# Altium schematic sheet buffer.SchDoc
size A3
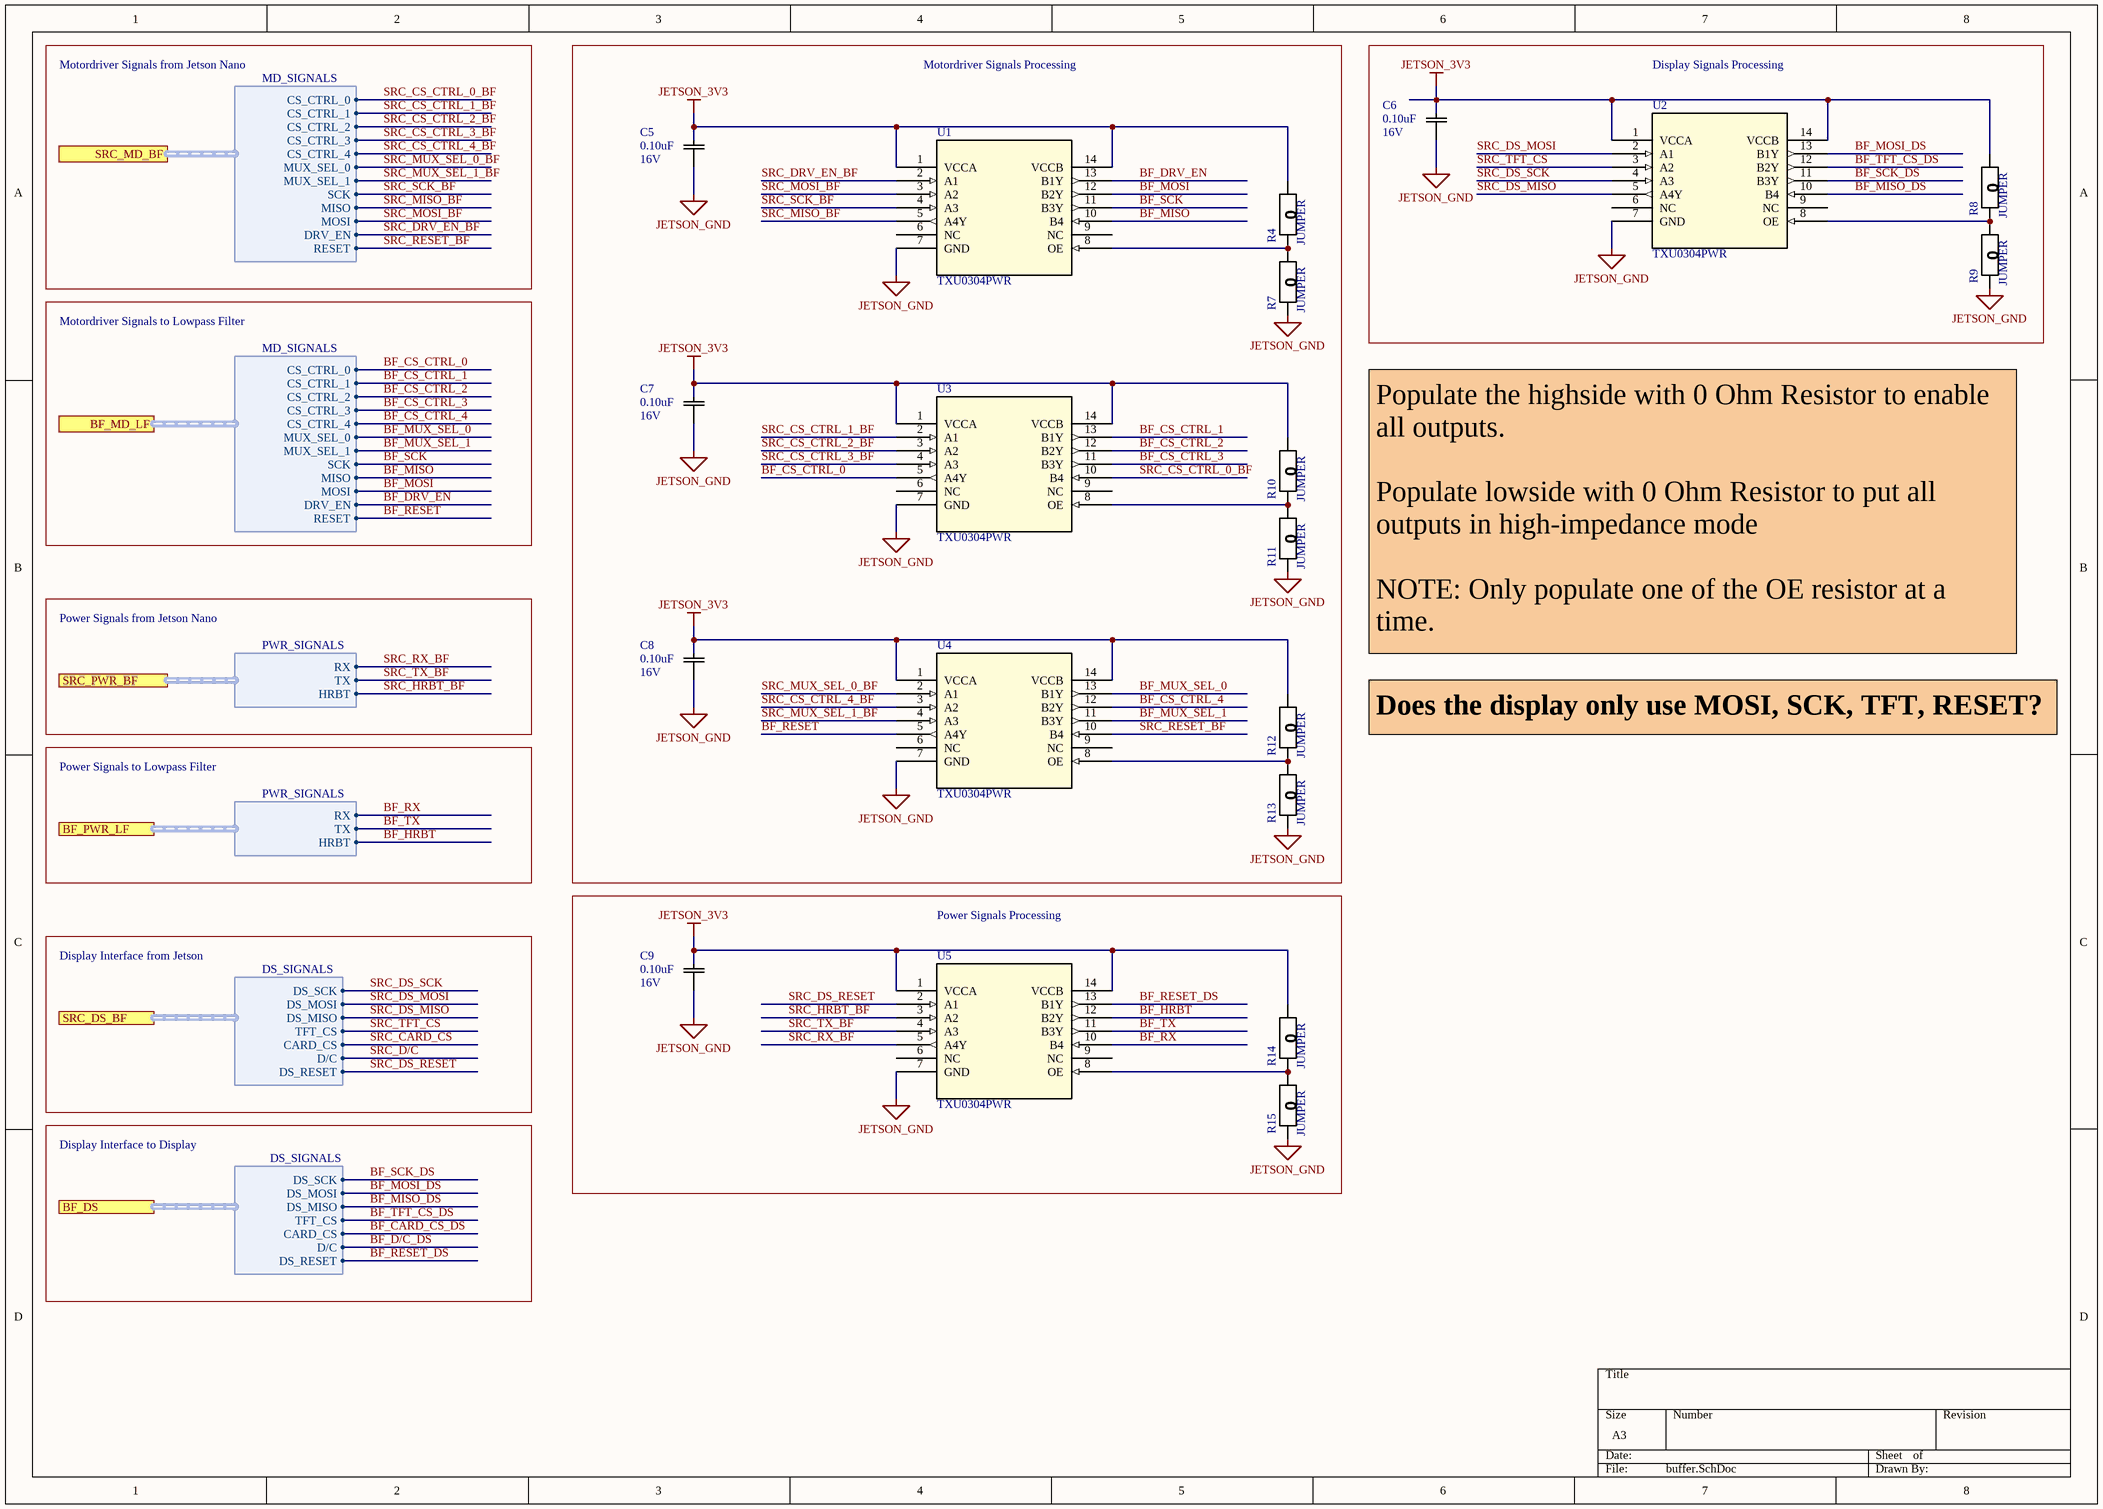
[diagram p0: buffer.SchDoc]

## Parts
C5  Rating: 16V  [0603]  (hidden comment: 0.10uF)
C6  Rating: 16V  [0603]  (hidden comment: 0.10uF)
C7  Rating: 16V  [0603]  (hidden comment: 0.10uF)
C8  Rating: 16V  [0603]  (hidden comment: 0.10uF)
C9  Rating: 16V  [0603]  (hidden comment: 0.10uF)
R4  JUMPER  [0603]
R7  JUMPER  [0603]
R8  JUMPER  [0603]
R9  JUMPER  [0603]
R10  JUMPER  [0603]
R11  JUMPER  [0603]
R12  JUMPER  [0603]
R13  JUMPER  [0603]
R14  JUMPER  [0603]
R15  JUMPER  [0603]
U1  TXU0304PWR  [14-TSSOP]
U2  TXU0304PWR  [14-TSSOP]
U3  TXU0304PWR  [14-TSSOP]
U4  TXU0304PWR  [14-TSSOP]
U5  TXU0304PWR  [14-TSSOP]

## Blocks framed on the sheet
Motordriver Signals Processing: C5 C7 C8 R4 R7 R10-R13 U1 U3 U4
Display Signals Processing: C6 R8 R9 U2
Power Signals Processing: C9 R14 R15 U5

## Ports
BF_DS (harness DS_SIGNALS), BF_MD_LF (harness MD_SIGNALS), BF_PWR_LF (harness PWR_SIGNALS), SRC_DS_BF (harness DS_SIGNALS), SRC_MD_BF (harness MD_SIGNALS), SRC_PWR_BF (harness PWR_SIGNALS)

## Harnesses
PWR_SIGNALS: TX, RX, HRBT
MD_SIGNALS: CS_CTRL_0, MUX_SEL_1, SCK, MOSI, MISO, CS_CTRL_1, CS_CTRL_2, CS_CTRL_3, CS_CTRL_4, MUX_SEL_0, DRV_EN, RESET
DS_SIGNALS: DS_SCK, DS_MOSI, DS_MISO, TFT_CS, CARD_CS, D/C, DS_RESET

## Nets
JETSON_3V3: C5.1(C1) C6.1(C1) C7.1(C1) C8.1(C1) C9.1(C1) R4.1(R1) R8.1(R1) R10.1(R1) R12.1(R1) R14.1(R1) U1.1(VCCA) U1.14(VCCB) U2.1(VCCA) U2.14(VCCB) U3.1(VCCA) U3.14(VCCB) U4.1(VCCA) U4.14(VCCB) U5.1(VCCA) U5.14(VCCB)
JETSON_GND: C5.2(C2) C6.2(C2) C7.2(C2) C8.2(C2) C9.2(C2) R7.2(R2) R9.2(R2) R11.2(R2) R13.2(R2) R15.2(R2) U1.7(GND) U2.7(GND) U3.7(GND) U4.7(GND) U5.7(GND)
BF_CARD_CS_DS: port BF_DS.CARD_CS
BF_CS_CTRL_0: U3.5(A4Y) ; port BF_MD_LF.CS_CTRL_0
BF_CS_CTRL_1: U3.13(B1Y) ; port BF_MD_LF.CS_CTRL_1
BF_CS_CTRL_2: U3.12(B2Y) ; port BF_MD_LF.CS_CTRL_2
BF_CS_CTRL_3: U3.11(B3Y) ; port BF_MD_LF.CS_CTRL_3
BF_CS_CTRL_4: U4.12(B2Y) ; port BF_MD_LF.CS_CTRL_4
BF_D/C_DS: port BF_DS.D/C
BF_DRV_EN: U1.13(B1Y) ; port BF_MD_LF.DRV_EN
BF_HRBT: U5.12(B2Y) ; port BF_PWR_LF.HRBT
BF_MISO: U1.10(B4) ; port BF_MD_LF.MISO
BF_MISO_DS: U2.10(B4) ; port BF_DS.DS_MISO
BF_MOSI: U1.12(B2Y) ; port BF_MD_LF.MOSI
BF_MOSI_DS: U2.13(B1Y) ; port BF_DS.DS_MOSI
BF_MUX_SEL_0: U4.13(B1Y) ; port BF_MD_LF.MUX_SEL_0
BF_MUX_SEL_1: U4.11(B3Y) ; port BF_MD_LF.MUX_SEL_1
BF_RESET: U4.5(A4Y) ; port BF_MD_LF.RESET
BF_RESET_DS: U5.13(B1Y) ; port BF_DS.DS_RESET
BF_RX: U5.10(B4) ; port BF_PWR_LF.RX
BF_SCK: U1.11(B3Y) ; port BF_MD_LF.SCK
BF_SCK_DS: U2.11(B3Y) ; port BF_DS.DS_SCK
BF_TFT_CS_DS: U2.12(B2Y) ; port BF_DS.TFT_CS
BF_TX: U5.11(B3Y) ; port BF_PWR_LF.TX
SRC_CARD_CS: port SRC_DS_BF.CARD_CS
SRC_CS_CTRL_0_BF: U3.10(B4) ; port SRC_MD_BF.CS_CTRL_0
SRC_CS_CTRL_1_BF: U3.2(A1) ; port SRC_MD_BF.CS_CTRL_1
SRC_CS_CTRL_2_BF: U3.3(A2) ; port SRC_MD_BF.CS_CTRL_2
SRC_CS_CTRL_3_BF: U3.4(A3) ; port SRC_MD_BF.CS_CTRL_3
SRC_CS_CTRL_4_BF: U4.3(A2) ; port SRC_MD_BF.CS_CTRL_4
SRC_D/C: port SRC_DS_BF.D/C
SRC_DRV_EN_BF: U1.2(A1) ; port SRC_MD_BF.DRV_EN
SRC_DS_MISO: U2.5(A4Y) ; port SRC_DS_BF.DS_MISO
SRC_DS_MOSI: U2.2(A1) ; port SRC_DS_BF.DS_MOSI
SRC_DS_RESET: U5.2(A1) ; port SRC_DS_BF.DS_RESET
SRC_DS_SCK: U2.4(A3) ; port SRC_DS_BF.DS_SCK
SRC_HRBT_BF: U5.3(A2) ; port SRC_PWR_BF.HRBT
SRC_MISO_BF: U1.5(A4Y) ; port SRC_MD_BF.MISO
SRC_MOSI_BF: U1.3(A2) ; port SRC_MD_BF.MOSI
SRC_MUX_SEL_0_BF: U4.2(A1) ; port SRC_MD_BF.MUX_SEL_0
SRC_MUX_SEL_1_BF: U4.4(A3) ; port SRC_MD_BF.MUX_SEL_1
SRC_RESET_BF: U4.10(B4) ; port SRC_MD_BF.RESET
SRC_RX_BF: U5.5(A4Y) ; port SRC_PWR_BF.RX
SRC_SCK_BF: U1.4(A3) ; port SRC_MD_BF.SCK
SRC_TFT_CS: U2.3(A2) ; port SRC_DS_BF.TFT_CS
SRC_TX_BF: U5.4(A3) ; port SRC_PWR_BF.TX
NetR4_2: R4.2(R2) R7.1(R1) U1.8(OE)
NetR8_2: R8.2(R2) R9.1(R1) U2.8(OE)
NetR10_2: R10.2(R2) R11.1(R1) U3.8(OE)
NetR12_2: R12.2(R2) R13.1(R1) U4.8(OE)
NetR14_2: R14.2(R2) R15.1(R1) U5.8(OE)

Not connected (* = marked no-connect by the designer): U1 6(NC) 9(NC); U2 6(NC) 9(NC); U3 6(NC) 9(NC); U4 6(NC) 9(NC); U5 6(NC) 9(NC)

## Notes on the sheet
- Motordriver Signals from Jetson Nano
- Motordriver Signals to Lowpass Filter
- Power Signals from Jetson Nano
- Populate the highside with 0 Ohm Resistor to enable all outputs.
  Populate lowside with 0 Ohm Resistor to put all outputs in high-impedance mode
  NOTE: Only populate one of the OE resistor at a time.
- Power Signals to Lowpass Filter
- Does the display only use MOSI, SCK, TFT, RESET?
- Display Interface from Jetson
- Display Interface to Display

## Library data of the parts
C5-C9 = CAP 0.10uF 16V: CAP CER 0.10UF 16V X5R 0603; Tolerance: 10%; Package: 0603/0805; Temperature Coefficient: X5R; Operating Temperature: -55°C ~ 85°C; Value: 0.10uF; Part Number: CAP 0.10uF 16V
R4 R7-R15 = RES 0 JUMPER: RES SMD 0 OHM JUMPER GENERIC 0603; Manufacturer Part Number 1: RK73Z1JTTD; Value: 0; Package: 0805; Part Number: RES 0 JUMPER; Tolerance: N/A; Supplier 1: Digi-Key; Supplier Part Number 1: 2019-RK73Z1JTTDCT-ND; Supplier URL 1: https://www.digikey.ca/en/products/detail/koa-speer-electronics-inc/RK73Z1JTTD/9845478
U1-U5 = TXU0304: 4-Bit Fixed Direction Voltage-Level Translator with Schmitt-Trigger Inputs  and 3-State Outputs; Mfr_Name: Texas Instruments; Copyright: Copyright (C) 2022 Ultra Librarian. All rights reserved.; Manufacturer_Part_Number: TXU0304PWR; Digi-Key_Part_Number_1: 296-TXU0304PWRTR-ND; Digi-Key_Part_Number_2: 296-TXU0304PWRCT-ND; Digi-Key_Part_Number_3: 296-TXU0304PWRDKR-ND; RefDes: RefDes; Type: DEV; Part Number: TXU0304; Supplier 1: Digi-Key; Supplier Part Number 1: 296-TXU0304PWRTR-ND; Supplier URL 1: https://www.digikey.ca/en/products/detail/texas-instruments/TXU0304PWR/14641423